# EAGLE schematic Stack-Proto-v00 (EAGLE 5.10)
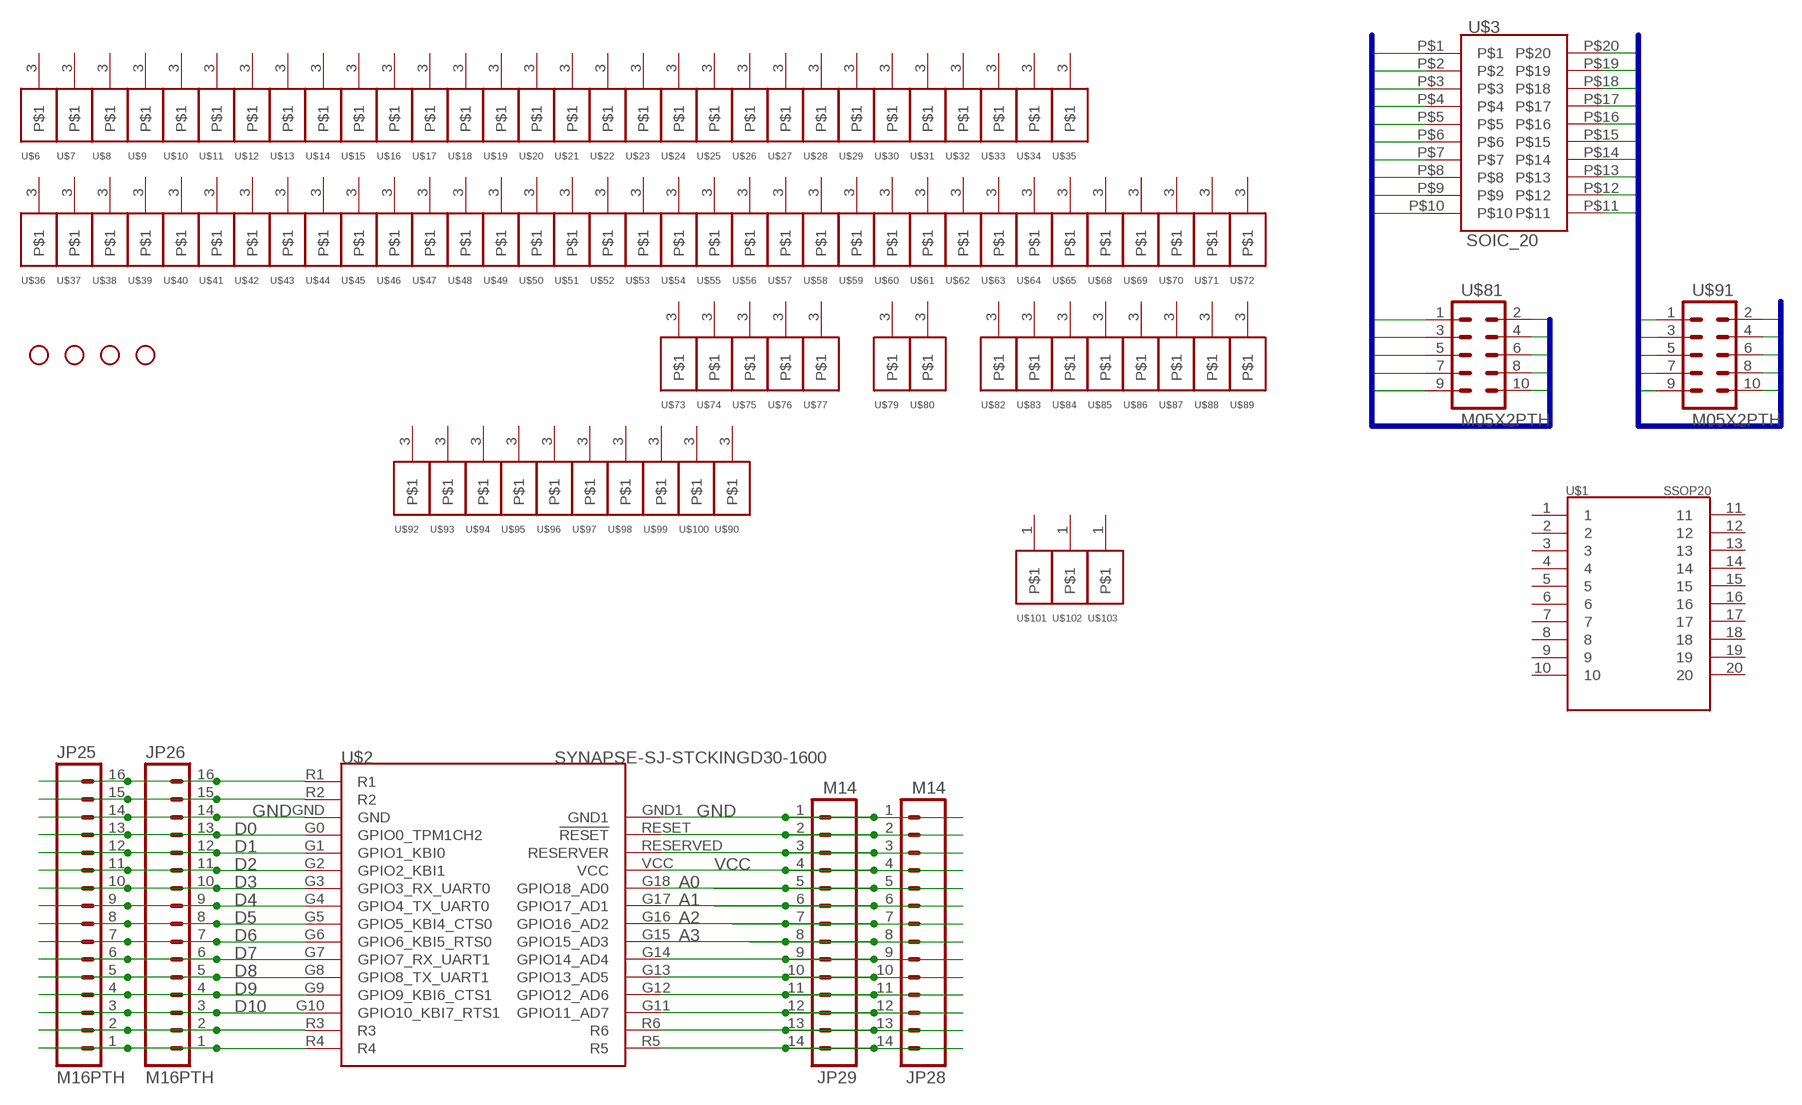
[diagram p0: schematic, sheet 1]

## Parts
JP1  STAND-OFF  [STAND-OFF]
JP2  STAND-OFF  [STAND-OFF]
JP3  STAND-OFF  [STAND-OFF]
JP4  STAND-OFF  [STAND-OFF]
JP25  M16PTH  [1X16]
JP26  M16PTH  [1X16]
JP28  M14  [1X14]
JP29  M14  [1X14]
U$1  SSOP20  [SSOP20-LONG]
U$2  SYNAPSE-SJ-STCKINGD30-1600  [SYNSJ-STACK]
U$3  SOIC_20  [SO20W]
U$6  BREADBOARDBB-1X03  [BB-1X3]
U$7  BREADBOARDBB-1X03  [BB-1X3]
U$8  BREADBOARDBB-1X03  [BB-1X3]
U$9  BREADBOARDBB-1X03  [BB-1X3]
U$10  BREADBOARDBB-1X03  [BB-1X3]
U$11  BREADBOARDBB-1X03  [BB-1X3]
U$12  BREADBOARDBB-1X03  [BB-1X3]
U$13  BREADBOARDBB-1X03  [BB-1X3]
U$14  BREADBOARDBB-1X03  [BB-1X3]
U$15  BREADBOARDBB-1X03  [BB-1X3]
U$16  BREADBOARDBB-1X03  [BB-1X3]
U$17  BREADBOARDBB-1X03  [BB-1X3]
U$18  BREADBOARDBB-1X03  [BB-1X3]
U$19  BREADBOARDBB-1X03  [BB-1X3]
U$20  BREADBOARDBB-1X03  [BB-1X3]
U$21  BREADBOARDBB-1X03  [BB-1X3]
U$22  BREADBOARDBB-1X03  [BB-1X3]
U$23  BREADBOARDBB-1X03  [BB-1X3]
U$24  BREADBOARDBB-1X03  [BB-1X3]
U$25  BREADBOARDBB-1X03  [BB-1X3]
U$26  BREADBOARDBB-1X03  [BB-1X3]
U$27  BREADBOARDBB-1X03  [BB-1X3]
U$28  BREADBOARDBB-1X03  [BB-1X3]
U$29  BREADBOARDBB-1X03  [BB-1X3]
U$30  BREADBOARDBB-1X03  [BB-1X3]
U$31  BREADBOARDBB-1X03  [BB-1X3]
U$32  BREADBOARDBB-1X03  [BB-1X3]
U$33  BREADBOARDBB-1X03  [BB-1X3]
U$34  BREADBOARDBB-1X03  [BB-1X3]
U$35  BREADBOARDBB-1X03  [BB-1X3]
U$36  BREADBOARDBB-1X03  [BB-1X3]
U$37  BREADBOARDBB-1X03  [BB-1X3]
U$38  BREADBOARDBB-1X03  [BB-1X3]
U$39  BREADBOARDBB-1X03  [BB-1X3]
U$40  BREADBOARDBB-1X03  [BB-1X3]
U$41  BREADBOARDBB-1X03  [BB-1X3]
U$42  BREADBOARDBB-1X03  [BB-1X3]
U$43  BREADBOARDBB-1X03  [BB-1X3]
U$44  BREADBOARDBB-1X03  [BB-1X3]
U$45  BREADBOARDBB-1X03  [BB-1X3]
U$46  BREADBOARDBB-1X03  [BB-1X3]
U$47  BREADBOARDBB-1X03  [BB-1X3]
U$48  BREADBOARDBB-1X03  [BB-1X3]
U$49  BREADBOARDBB-1X03  [BB-1X3]
U$50  BREADBOARDBB-1X03  [BB-1X3]
U$51  BREADBOARDBB-1X03  [BB-1X3]
U$52  BREADBOARDBB-1X03  [BB-1X3]
U$53  BREADBOARDBB-1X03  [BB-1X3]
U$54  BREADBOARDBB-1X03  [BB-1X3]
U$55  BREADBOARDBB-1X03  [BB-1X3]
U$56  BREADBOARDBB-1X03  [BB-1X3]
U$57  BREADBOARDBB-1X03  [BB-1X3]
U$58  BREADBOARDBB-1X03  [BB-1X3]
U$59  BREADBOARDBB-1X03  [BB-1X3]
U$60  BREADBOARDBB-1X03  [BB-1X3]
U$61  BREADBOARDBB-1X03  [BB-1X3]
U$62  BREADBOARDBB-1X03  [BB-1X3]
U$63  BREADBOARDBB-1X03  [BB-1X3]
U$64  BREADBOARDBB-1X03  [BB-1X3]
U$65  BREADBOARDBB-1X03  [BB-1X3]
U$68  BREADBOARDBB-1X03  [BB-1X3]
U$69  BREADBOARDBB-1X03  [BB-1X3]
U$70  BREADBOARDBB-1X03  [BB-1X3]
U$71  BREADBOARDBB-1X03  [BB-1X3]
U$72  BREADBOARDBB-1X03  [BB-1X3]
U$73  BREADBOARDBB-1X03  [BB-1X3]
U$74  BREADBOARDBB-1X03  [BB-1X3]
U$75  BREADBOARDBB-1X03  [BB-1X3]
U$76  BREADBOARDBB-1X03  [BB-1X3]
U$77  BREADBOARDBB-1X03  [BB-1X3]
U$79  BREADBOARDBB-1X03  [BB-1X3]
U$80  BREADBOARDBB-1X03  [BB-1X3]
U$81  M05X2PTH  [AVR_ICSP]
U$82  BREADBOARDBB-1X03  [BB-1X3]
U$83  BREADBOARDBB-1X03  [BB-1X3]
U$84  BREADBOARDBB-1X03  [BB-1X3]
U$85  BREADBOARDBB-1X03  [BB-1X3]
U$86  BREADBOARDBB-1X03  [BB-1X3]
U$87  BREADBOARDBB-1X03  [BB-1X3]
U$88  BREADBOARDBB-1X03  [BB-1X3]
U$89  BREADBOARDBB-1X03  [BB-1X3]
U$90  BREADBOARDBB-1X03  [BB-1X3]
U$91  M05X2PTH  [AVR_ICSP]
U$92  BREADBOARDBB-1X03  [BB-1X3]
U$93  BREADBOARDBB-1X03  [BB-1X3]
U$94  BREADBOARDBB-1X03  [BB-1X3]
U$95  BREADBOARDBB-1X03  [BB-1X3]
U$96  BREADBOARDBB-1X03  [BB-1X3]
U$97  BREADBOARDBB-1X03  [BB-1X3]
U$98  BREADBOARDBB-1X03  [BB-1X3]
U$99  BREADBOARDBB-1X03  [BB-1X3]
U$100  BREADBOARDBB-1X03  [BB-1X3]
U$101  BREADBOARDBB-2X20  [BB-2X20]
U$102  BREADBOARDBB-2X20  [BB-2X20]
U$103  BREADBOARDBB-2X20  [BB-2X20]

## Nets
A0: JP28.5 JP29.5 U$2.G18(GPIO18_AD0)
A1: JP28.6 JP29.6 U$2.G17(GPIO17_AD1)
A2: JP28.7 JP29.7 U$2.G16(GPIO16_AD2)
A3: JP28.8 JP29.8 U$2.G15(GPIO15_AD3)
D0: JP25.13 JP26.13 U$2.G0(GPIO0_TPM1CH2)
D1: JP25.12 JP26.12 U$2.G1(GPIO1_KBI0)
D2: JP25.11 JP26.11 U$2.G2(GPIO2_KBI1)
D3: JP25.10 JP26.10 U$2.G3(GPIO3_RX_UART0)
D4: JP25.9 JP26.9 U$2.G4(GPIO4_TX_UART0)
D5: JP25.8 JP26.8 U$2.G5(GPIO5_KBI4_CTS0)
D6: JP25.7 JP26.7 U$2.G6(GPIO6_KBI5_RTS0)
D7: JP25.6 JP26.6 U$2.G7(GPIO7_RX_UART1)
D8: JP25.5 JP26.5 U$2.G8(GPIO8_TX_UART1)
D9: JP25.4 JP26.4 U$2.G9(GPIO9_KBI6_CTS1)
D10: JP25.3 JP26.3 U$2.G10(GPIO10_KBI7_RTS1)
GND: JP25.14 JP26.14 JP28.1 JP29.1 U$2.GND U$2.GND1
N$11: JP25.1 JP26.1 U$2.R4
N$12: JP25.2 JP26.2 U$2.R3
N$25: JP25.15 JP26.15 U$2.R2
N$26: JP25.16 JP26.16 U$2.R1
N$27: JP28.2 JP29.2 U$2.RESET(!RESET)
N$28: JP28.3 JP29.3 U$2.RESERVED(RESERVER)
N$29: JP28.9 JP29.9 U$2.G14(GPIO14_AD4)
N$30: JP28.10 JP29.10 U$2.G13(GPIO13_AD5)
N$31: JP28.11 JP29.11 U$2.G12(GPIO12_AD6)
N$32: JP28.12 JP29.12 U$2.G11(GPIO11_AD7)
N$33: JP28.13 JP29.13 U$2.R6
N$34: JP28.14 JP29.14 U$2.R5
S1: U$3.P$1 U$81.1
S2: U$3.P$2 U$81.2
S3: U$3.P$3 U$81.3
S4: U$3.P$4 U$81.4
S5: U$3.P$5 U$81.5
S6: U$3.P$6 U$81.6
S7: U$3.P$7 U$81.7
S8: U$3.P$8 U$81.8
S9: U$3.P$9 U$81.9
S10: U$3.P$10 U$81.10
S11: U$3.P$11 U$91.1
S12: U$3.P$12 U$91.2
S13: U$3.P$13 U$91.3
S14: U$3.P$14 U$91.4
S15: U$3.P$15 U$91.5
S16: U$3.P$16 U$91.6
S17: U$3.P$17 U$91.7
S18: U$3.P$18 U$91.8
S19: U$3.P$19 U$91.9
S20: U$3.P$20 U$91.10
VCC: JP28.4 JP29.4 U$2.VCC
Unconnected: U$1.1 U$1.2 U$1.3 U$1.4 U$1.5 U$1.6 U$1.7 U$1.8 U$1.9 U$1.10 U$1.11 U$1.12 U$1.13 U$1.14 U$1.15 U$1.16 U$1.17 U$1.18 U$1.19 U$1.20 U$6.3 U$7.3 U$8.3 U$9.3 U$10.3 U$11.3 U$12.3 U$13.3 U$14.3 U$15.3 U$16.3 U$17.3 U$18.3 U$19.3 U$20.3 U$21.3 U$22.3 U$23.3 U$24.3 U$25.3 U$26.3 U$27.3 U$28.3 U$29.3 U$30.3 U$31.3 U$32.3 U$33.3 U$34.3 U$35.3 U$36.3 U$37.3 U$38.3 U$39.3 U$40.3 U$41.3 U$42.3 U$43.3 U$44.3 U$45.3 U$46.3 U$47.3 U$48.3 U$49.3 U$50.3 U$51.3 U$52.3 U$53.3 U$54.3 U$55.3 U$56.3 U$57.3 U$58.3 U$59.3 U$60.3 U$61.3 U$62.3 U$63.3 U$64.3 U$65.3 U$68.3 U$69.3 U$70.3 U$71.3 U$72.3 U$73.3 U$74.3 U$75.3 U$76.3 U$77.3 U$79.3 U$80.3 U$82.3 U$83.3 U$84.3 U$85.3 U$86.3 U$87.3 U$88.3 U$89.3 U$90.3 U$92.3 U$93.3 U$94.3 U$95.3 U$96.3 U$97.3 U$98.3 U$99.3 U$100.3 U$101.1 U$102.1 U$103.1

## Buses
S[1..10]
S[11..20]

## Library data of the parts
JP1-JP4 = SparkFun:STAND-OFF: Stand Off This is the mechanical footprint for a #4 phillips button head screw. Use the keepout ring to avoid running the screw head into surrounding components. SKU : PRT-00447
JP25 JP26 = SparkFun:M16
JP28 JP29 = SparkFun:M14: Header 14 Standard 14-pin 0.1" header. Use with straight break away headers (SKU : PRT-00116), right angle break away headers (PRT-00553), swiss pins (PRT-00743), machine pins (PRT-00117), and female headers (PRT-00115).
U$1 = SparkFun:SSOP20
U$2 = 0_jc-custom:SYNAPSE-SJ-STCKING: Standard layout for expansion modules using Synapse Wireless boards
U$3 = SparkFun:SOIC_20
U$6-U$65 U$68-U$77 U$79 U$80 U$82-U$90 U$92-U$103 = 0_jc-custom:BREADBOARD
U$81 U$91 = SparkFun:M05X2: Header 5x2 Standard 10-pin dual row 0.1" header. Commonly used with AVR-ISP. Use with Spark Fun Electronics SKU: PRT-00778